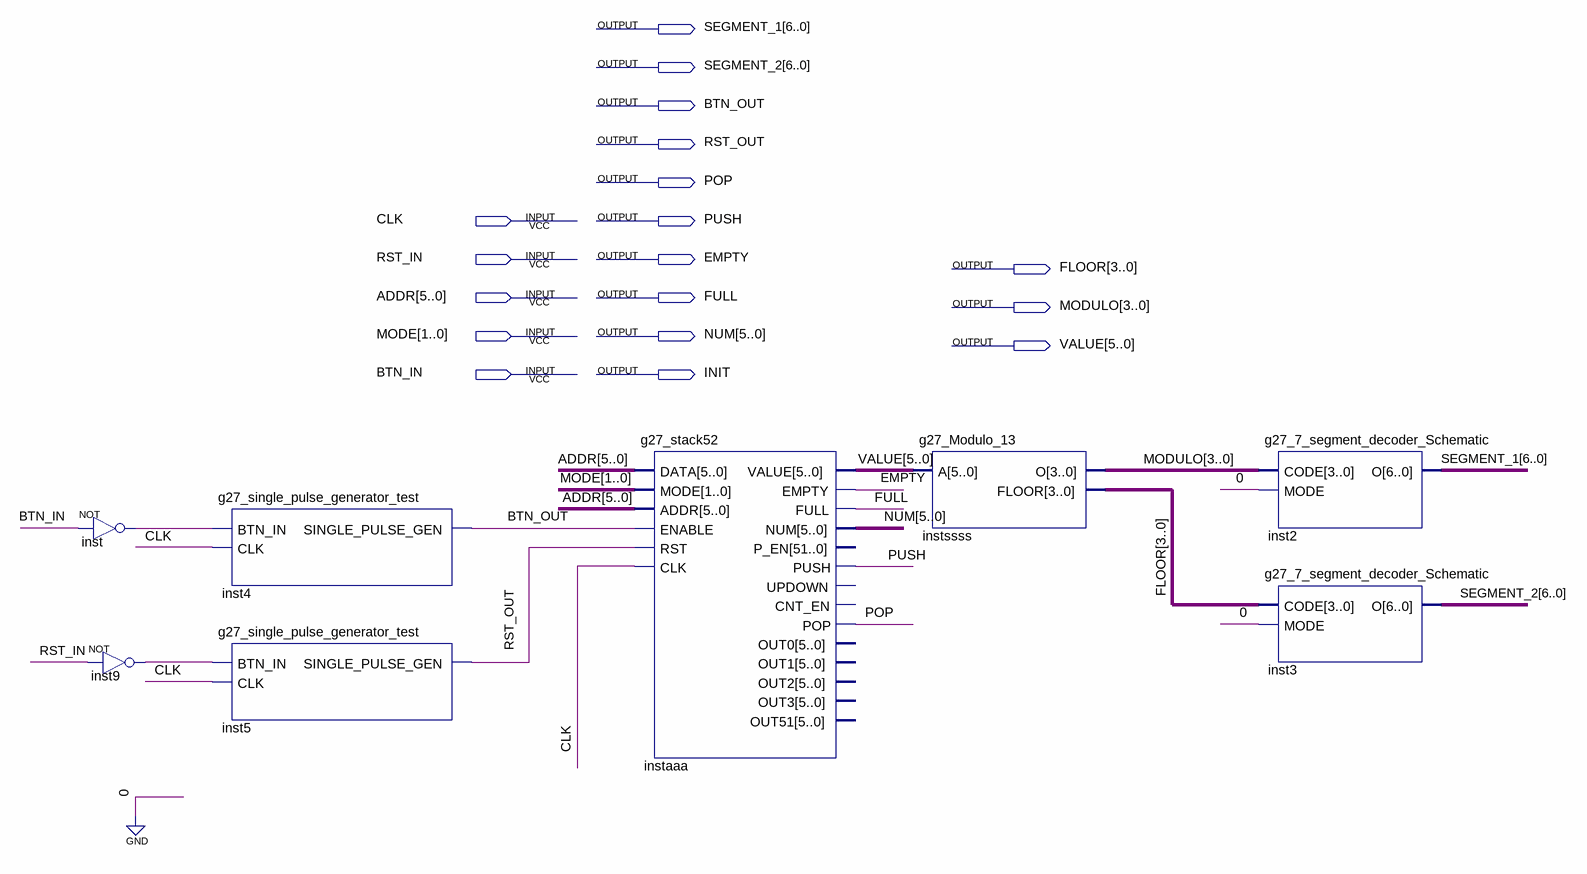
[diagram p0: schematic sheet]
// Quartus schematic g27_test_bed_test.bdf as structural Verilog: 8 symbols, 18 pins
module g27_test_bed_test (
  input  CLK,
  input  RST_IN,
  input  [5:0] ADDR,
  input  [1:0] MODE,
  input  BTN_IN,
  output [6:0] SEGMENT_1,
  output [6:0] SEGMENT_2,
  output BTN_OUT,
  output RST_OUT,
  output POP,
  output PUSH,
  output EMPTY,
  output [3:0] FLOOR,
  output FULL,
  output [3:0] MODULO,
  output [5:0] NUM,
  output [5:0] VALUE,
  output INIT
);

  wire inst9_out, inst_out;

  not inst (inst_out, BTN_IN);
  not inst9 (inst9_out, RST_IN);
  g27_single_pulse_generator_test inst4 (.BTN_IN(inst_out), .CLK(CLK), .SINGLE_PULSE_GEN(BTN_OUT));
  g27_single_pulse_generator_test inst5 (.BTN_IN(inst9_out), .CLK(CLK), .SINGLE_PULSE_GEN(RST_OUT));
  g27_stack52 instaaa (
    .DATA(ADDR), .MODE(MODE), .ADDR(ADDR), .ENABLE(BTN_OUT), .RST(RST_OUT), .CLK(CLK), .VALUE(VALUE),
    .EMPTY(EMPTY), .FULL(FULL), .NUM(NUM), .PUSH(PUSH), .POP(POP));  // open: P_EN, UPDOWN, CNT_EN, OUT0, OUT1, OUT2, OUT3, OUT51
  g27_Modulo_13 instssss (.A(VALUE), .O(MODULO), .FLOOR(FLOOR));
  g27_7_segment_decoder_Schematic inst2 (.CODE(MODULO), .MODE(1'b0), .O(SEGMENT_1));
  g27_7_segment_decoder_Schematic inst3 (.CODE(FLOOR), .MODE(1'b0), .O(SEGMENT_2));
endmodule
